# Altium schematic sheet AnalogConnectors.SchDoc: Set in Document Options » Parameters » Title
size Tabloid; Author: Set in Document Options » Parameters » Author + Contact info
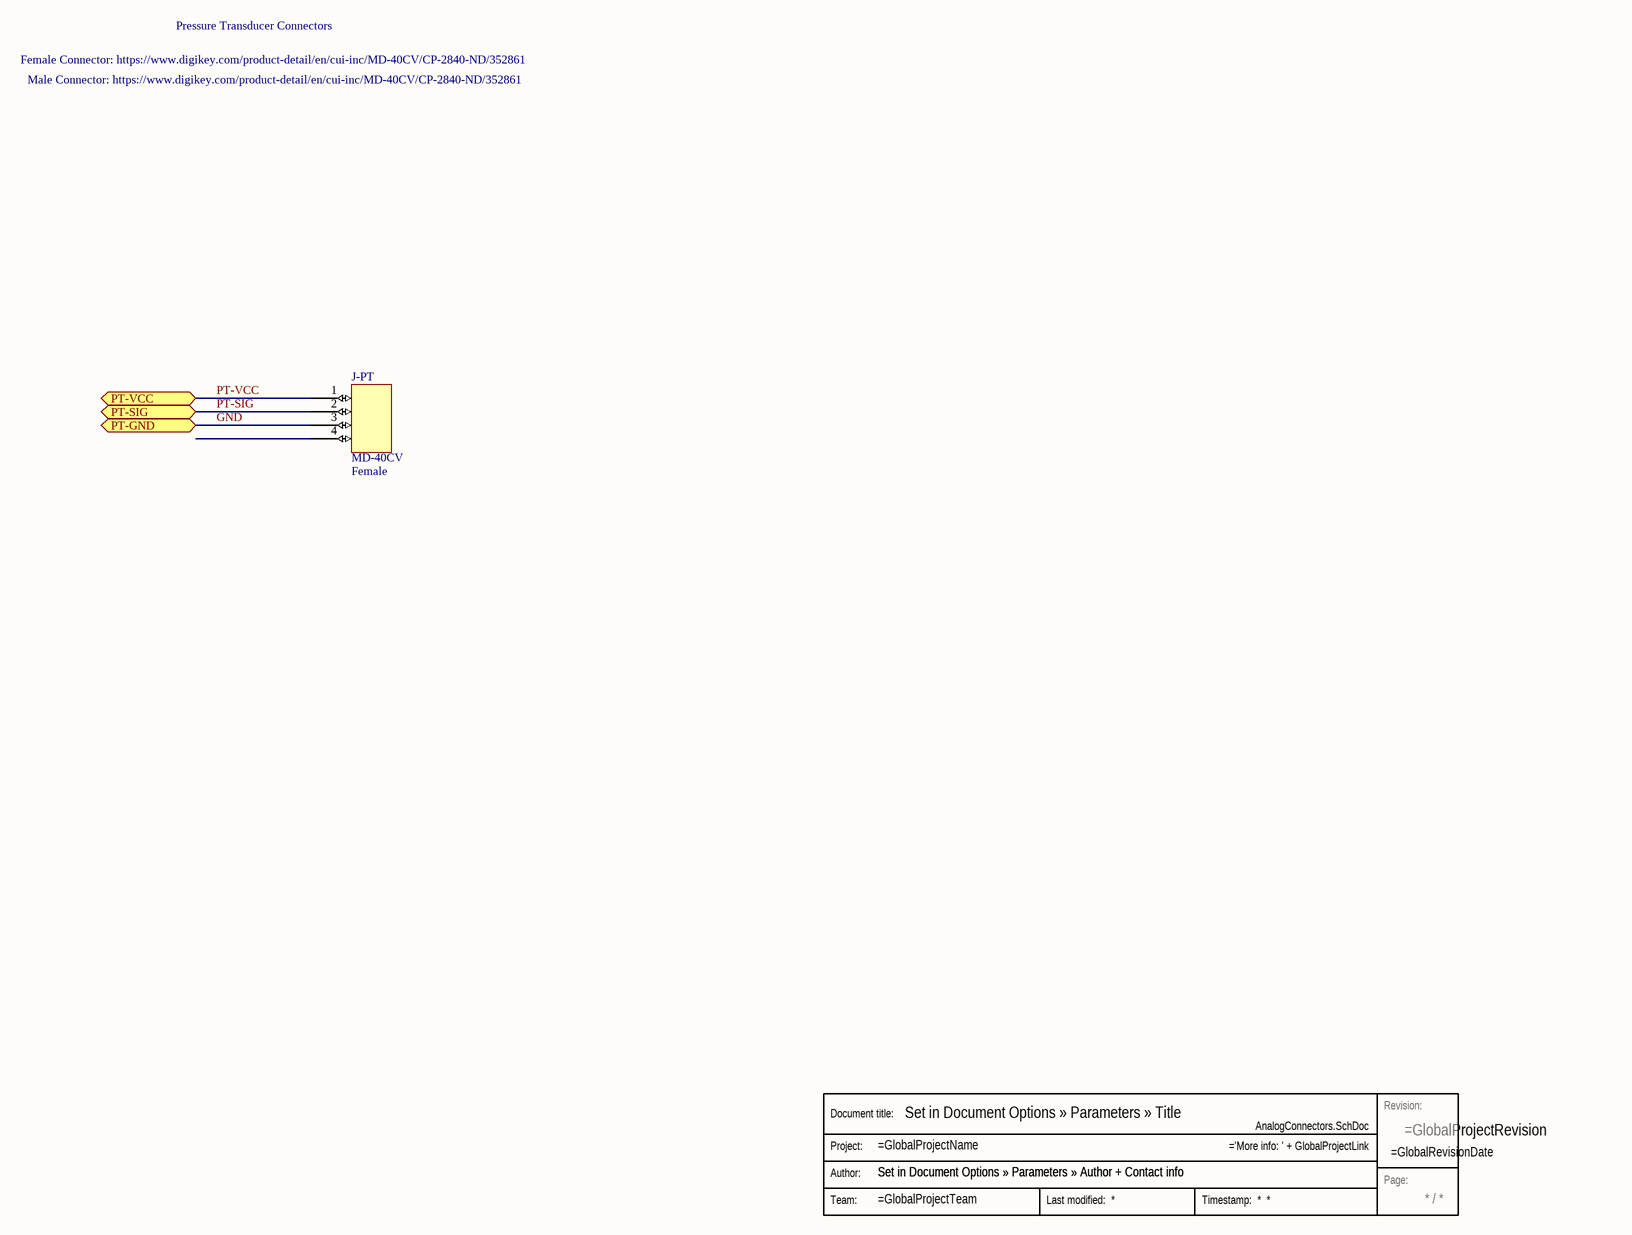
[diagram p0: AnalogConnectors.SchDoc]

## Parts
J-PT  Gender: Female  (hidden comment: MD-40CV)
Stamp  Stamp  (value not drawn)  (graphical)

## Ports
PT-GND, PT-SIG, PT-VCC

## Nets
GND: J-PT.3 ; port PT-GND
PT-SIG: J-PT.2 ; port PT-SIG
PT-VCC: J-PT.1 ; port PT-VCC

Not connected (* = marked no-connect by the designer): J-PT 4

## Notes on the sheet
- Pressure Transducer Connectors
- Female Connector: https://www.digikey.com/product-detail/en/cui-inc/MD-40CV/CP-2840-ND/352861
- Male Connector: https://www.digikey.com/product-detail/en/cui-inc/MD-40CV/CP-2840-ND/352861
- (in symbol Stamp) Revision:; Document title:; Project:; Author:; Page:; Team:

## Library data of the parts
J-PT = MD-40CV: Manufacturer: CUI, Inc.; Digikey Link: https://www.digikey.com/product-detail/en/cui-inc/MD-40CV/CP-2840-ND/352861; Digikey P/N: CP-2840-ND; Manufacturer P/N: MD-40CV